# Altium schematic sheet Sheet2.SchDoc
size A4
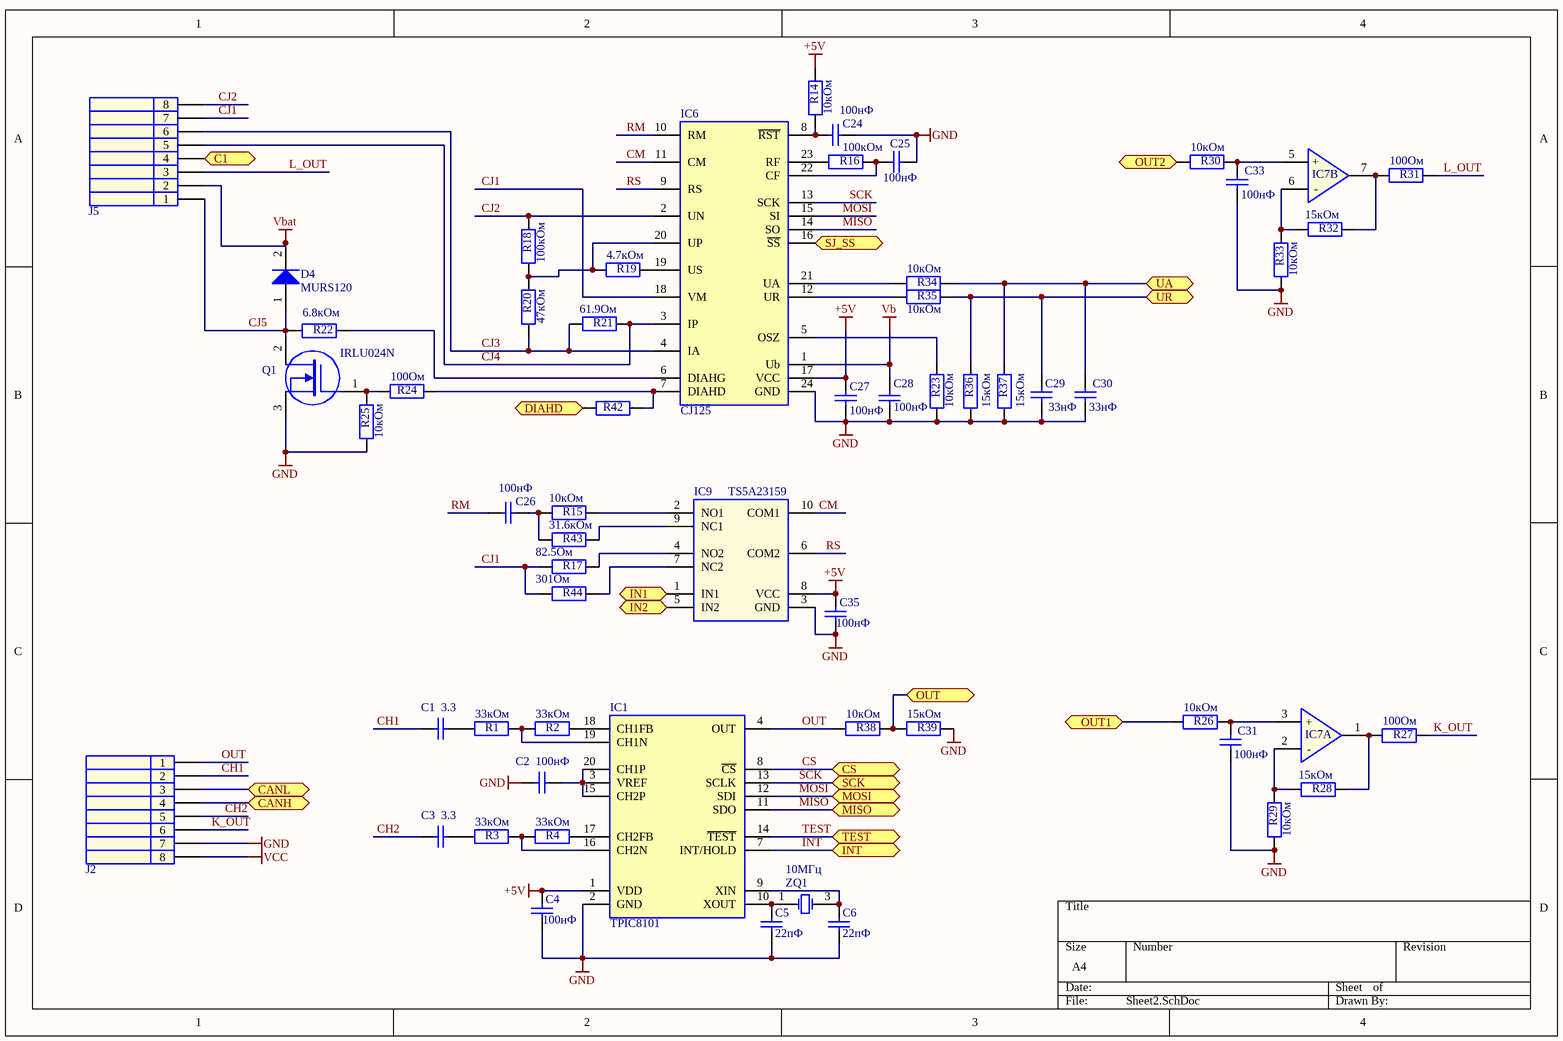
[diagram p0: Sheet2.SchDoc]

## Parts
C1  value 3.3  [0603]  (hidden comment: Cap)
C2  value 100нФ  [0603]  (hidden comment: Cap)
C3  value 3.3  [0603]  (hidden comment: Cap)
C4  value 100нФ  [0603]  (hidden comment: Cap)
C5  value 22пФ  [0603]  (hidden comment: Cap)
C6  value 22пФ  [0603]  (hidden comment: Cap)
C24  value 100нФ  [0603]  (hidden comment: Cap)
C25  value 100нФ  [0603]  (hidden comment: Cap)
C26  value 100нФ  [0603]  (hidden comment: Cap)
C27  value 100нФ  [0603]  (hidden comment: Cap)
C28  value 100нФ  [0603]  (hidden comment: Cap)
C29  value 33нФ  [0603]  (hidden comment: Cap)
C30  value 33нФ  [0603]  (hidden comment: Cap)
C31  value 100нФ  [0603]  (hidden comment: Cap)
C33  value 100нФ  [0603]  (hidden comment: Cap)
C35  value 100нФ  [0603]  (hidden comment: Cap)
D4  value MURS120  [DO-214AA]  (hidden comment: Diode)
IC1  TPIC8101  [SOL-20]
IC6  CJ125  [SOL24_1.27_11.4_7.4]
IC7  LM258  [SO-8]  (value not drawn)  (parts A,B of 3)
IC9  TS5A23159  [PUQFN-N10]
J2  s-8  [43045-0800-wo]  (value not drawn)
J5  s-8  [43045-0800-wo]  (value not drawn)
Q1  value IRLU024N  [TO-252]  (hidden comment: MOSFET_N_CH)
R1  value 33кОм  [0603]  (hidden comment: Res)
R2  value 33кОм  [0603]  (hidden comment: Res)
R3  value 33кОм  [0603]  (hidden comment: Res)
R4  value 33кОм  [0603]  (hidden comment: Res)
R14  value 10кОм  [0603]  (hidden comment: Res)
R15  value 10кОм  [0603]  (hidden comment: Res)
R16  value 100кОм  [0603]  (hidden comment: Res)
R17  value 82.5Ом  [0603]  (hidden comment: Res)
R18  value 100кОм  [0603]  (hidden comment: Res)
R19  value 4.7кОм  [0603]  (hidden comment: Res)
R20  value 47кОм  [0603]  (hidden comment: Res)
R21  value 61.9Ом  [0603]  (hidden comment: Res)
R22  value 6.8кОм  [0603]  (hidden comment: Res)
R23  value 10кОм  [0603]  (hidden comment: Res)
R24  value 100Ом  [0603]  (hidden comment: Res)
R25  value 10кОм  [0603]  (hidden comment: Res)
R26  value 10кОм  [0603]  (hidden comment: Res)
R27  value 100Ом  [0603]  (hidden comment: Res)
R28  value 15кОм  [0603]  (hidden comment: Res)
R29  value 10кОм  [0603]  (hidden comment: Res)
R30  value 10кОм  [0603]  (hidden comment: Res)
R31  value 100Ом  [0603]  (hidden comment: Res)
R32  value 15кОм  [0603]  (hidden comment: Res)
R33  value 10кОм  [0603]  (hidden comment: Res)
R34  value 10кОм  [0603]  (hidden comment: Res)
R35  value 10кОм  [0603]  (hidden comment: Res)
R36  value 15кОм  [0603]  (hidden comment: Res)
R37  value 15кОм  [0603]  (hidden comment: Res)
R38  value 10кОм  [0603]  (hidden comment: Res)
R39  value 15кОм  [0603]  (hidden comment: Res)
R42  Res  [0603]  (value not drawn)
R43  value 31.6кОм  [0603]  (hidden comment: Res)
R44  value 301Ом  [0603]  (hidden comment: Res)
ZQ1  value 10МГц  [KX-9A]  (hidden comment: QUARTZ_2)

## Ports
C1, CANH, CANL, CS, DIAHD, IN1, IN2, INT, MISO, MOSI, OUT, OUT1, OUT2, SCK, SJ_SS, TEST, UA, UR

## Nets
+5V: C4.2 C27.1 C35.2 IC1.1(VDD) IC6.17(VCC) IC9.8(VCC) R14.2
GND: C2.1 C4.1 C5.1 C6.1 C24.1 C25.1 C27.2 C28.2 C29.2 C30.2 C31.1 C33.1 C35.1 IC1.2(GND) IC6.24(GND) IC9.3(GND) J2.7 Q1.3(S) R23.1 R25.1 R29.1 R33.1 R36.2 R37.2 R39.1
Vb: C28.1 IC6.1(Ub)
Vbat: D4.2(K) J5.2
VCC: J2.8
C1: J5.4 ; port C1
CANH: J2.4 ; port CANH
CANL: J2.3 ; port CANL
CH1: C1.1 J2.2
CH2: C3.1 J2.5
CJ1: IC6.18(VM) J5.7 R17.1 R44.1
CJ2: IC6.2(UN) J5.8 R18.2
CJ3: IC6.4(IA) J5.6 R20.1 R21.1
CJ4: IC6.3(IP) J5.5 R21.2
CJ5: D4.1(A) J5.1 Q1.2(D) R22.2
CM: IC6.11(CM) IC9.10(COM1)
CS: IC1.8(~{CS}) ; port CS
DIAHD: R42.2 ; port DIAHD
IN1: IC9.1(IN1) ; port IN1
IN2: IC9.5(IN2) ; port IN2
INT: IC1.7(INT/HOLD) ; port INT
K_OUT: J2.6 R27.1
L_OUT: J5.3 R31.1
MISO: IC1.11(SDO) IC6.14(SO) ; port MISO
MOSI: IC1.12(SDI) IC6.15(SI) ; port MOSI
OUT: IC1.4(OUT) J2.1 R38.2
OUT: R38.1 R39.2 ; port OUT  [a separate net that carries the same name]
OUT1: R26.2 ; port OUT1
OUT2: R30.2 ; port OUT2
RM: C26.2 IC6.10(RM)
RS: IC6.9(RS) IC9.6(COM2)
SCK: IC1.13(SCLK) IC6.13(SCK) ; port SCK
SJ_SS: IC6.16(~{SS}) ; port SJ_SS
TEST: IC1.14(~{TEST}) ; port TEST
UA: C30.1 R34.1 R37.1 ; port UA
UR: C29.1 R35.1 R36.1 ; port UR
NetC1_2: C1.2 R1.1
NetC2_2: C2.2 IC1.3(VREF) IC1.15(CH2P) IC1.20(CH1P)
NetC3_2: C3.2 R3.1
NetC5_2: C5.2 IC1.10(XOUT) ZQ1.1(OSC1)
NetC6_2: C6.2 IC1.9(XIN) ZQ1.3(OSC2)
NetC24_2: C24.2 IC6.8(~{RST}) R14.1
NetC25_2: C25.2 IC6.22(CF) R16.1
NetC26_1: C26.1 R15.1 R43.1
NetC31_2: C31.2 IC7.3(+) R26.1
NetC33_2: C33.2 IC7.5(+) R30.1
NetIC1_16: IC1.16(CH2N) R3.2 R4.1
NetIC1_17: IC1.17(CH2FB) R4.2
NetIC1_18: IC1.18(CH1FB) R2.2
NetIC1_19: IC1.19(CH1N) R1.2 R2.1
NetIC6_5: IC6.5(OSZ) R23.2
NetIC6_6: IC6.6(DIAHG) R22.1
NetIC6_7: IC6.7(DIAHD) R24.1 R42.1
NetIC6_12: IC6.12(UR) R35.2
NetIC6_19: IC6.19(US) R19.2
NetIC6_20: IC6.20(UP) R18.1 R19.1 R20.2
NetIC6_21: IC6.21(UA) R34.2
NetIC6_23: IC6.23(RF) R16.2
NetIC7_1: IC7.1(OUT) R27.2 R28.2
NetIC7_2: IC7.2(-) R28.1 R29.2
NetIC7_6: IC7.6(-) R32.1 R33.2
NetIC7_7: IC7.7(OUT) R31.2 R32.2
NetIC9_2: IC9.2(NO1) R15.2
NetIC9_4: IC9.4(NO2) R17.2
NetIC9_7: IC9.7(NC2) R44.2
NetIC9_9: IC9.9(NC1) R43.2
NetQ1_1: Q1.1(G) R24.2 R25.2

## Library data of the parts
C1 C3 = Cap: Capacitor; Order: 3.3нФ 10% 50В 0805; Group: Конденсаторы; Function: Конденсатор неполярный; Manufacturer: ?; Case: 0805
C2 C4 C24-C28 C31 C33 C35 = Cap: Capacitor; Order: 100нФ 10% 50В 0805; Group: Конденсаторы; Function: Конденсатор неполярный; Manufacturer: ?
  C2 C4 C35: Case: 0805
  C24-C28 C31 C33: Case: ?
C5 C6 = Cap: Capacitor; Order: 22пФ 10% 50В 0805; Group: Конденсаторы; Function: Конденсатор неполярный; Manufacturer: ?; Case: 0805
C29 C30 = Cap: Capacitor; Order: 33нФ 10% 50В 0805; Group: Конденсаторы; Function: Конденсатор неполярный; Manufacturer: ?; Case: ?
D4 = Diode: Group: Диоды; Function: Диод выпрямительный; Order: MURS120; manufacturer: ?; Case: DO-214AA
IC1 = TPIC8101: Manufacturer: Texas Instruments; Group: Микросхемы; Function: Knock Sensor Interface; Case: SOIC-20; Order: TPIC8101; Value: TPIC8101
IC6 = CJ125: Manufacturer: infinion; Group: Микросхемы; Function: Lambda Probe Interface; Case: ?; Order: CJ125; Value: CJ125
IC7 = LM258: Manufacturer: Texas Instruments; Group: Микросхемы; Order: LM258D; Function: ОУ; Value: LM258; Case: SO-8
IC9 = TS5A23159: Manufacturer: Texas Instruments; Function: 1-Ω 2-Channel SPDT Analog Switch; Group: Микросхемы; Order: PUQFN-N10; Case: TS5A23159; Value: TS5A23159
J2 J5 = s-8: Order: 43045-0800; Group: Разъемы; Function: Разъем; Value: ?; Case: ?; Manufacturer: ?
Q1 = MOSFET_N_CH: Group: Транзисторы; Order: IRLU024N; Case: TO-252; Manufacturer: ?; Function: ?
R1-R4 = Res: Resistor; Order: 33кОм 5% 0805; Group: Резисторы; Function: Резистор постоянный; Case: 0805; Manufacturer: ?
R14 R15 R23 R25 R26 R29 R30 R33-R35 R38 = Res: Resistor; Order: 10кОм 5% 0805; Group: Резисторы; Function: Резистор постоянный; Manufacturer: ?
  R14 R23 R25: Case: 0805
  R15 R26 R29 R30 R33-R35 R38: Case: ?
R16 R18 = Res: Resistor; Order: 100кОм 5% 0805; Group: Резисторы; Function: Резистор постоянный; Case: 0805; Manufacturer: ?
R17 R19 = Res: Resistor; Order: 82.5Ом 5% 0805; Group: Резисторы; Function: Резистор постоянный; Case: 0805; Manufacturer: ?
R20 = Res: Resistor; Order: 47кОм 5% 0805; Group: Резисторы; Function: Резистор постоянный; Case: 0805; Manufacturer: ?
R21 = Res: Resistor; Order: 61,9Ом 5% 0805; Group: Резисторы; Function: Резистор постоянный; Case: 0805; Manufacturer: ?
R22 = Res: Resistor; Order: 6.8кОм 5% 0805; Group: Резисторы; Function: Резистор постоянный; Case: 0805; Manufacturer: ?
R24 R27 R31 = Res: Resistor; Order: 100Ом 5% 0805; Group: Резисторы; Function: Резистор постоянный; Manufacturer: ?
  R24: Case: 0805
  R27 R31: Case: ?
R28 R32 R36 R37 R39 = Res: Resistor; Order: 15кОм 5% 0805; Group: Резисторы; Function: Резистор постоянный; Case: ?; Manufacturer: ?
R42 = Res: Resistor; Order: 100Ом 5% 0805; Group: Резисторы; Function: Резистор постоянный; Value: 100Ом; Case: ?; Manufacturer: ?
R43 = Res: Resistor; Order: 31.6кОм 5% 0805; Group: Резисторы; Function: Резистор постоянный; Case: ?; Manufacturer: ?
R44 = Res: Resistor; Order: 301Ом 5% 0805; Group: Резисторы; Function: Резистор постоянный; Case: 0805; Manufacturer: ?
ZQ1 = KX-9A: Crystal Oscillator; Manufacturer: Кварцевый резонатор; Group: Резонаторы; Order: 10МГц; Case: KX-9A; Function: Crystal Oscillator